# EAGLE schematic Arturo_Verasv2 (EAGLE 8.3.2)
Circuito Anti-jammer
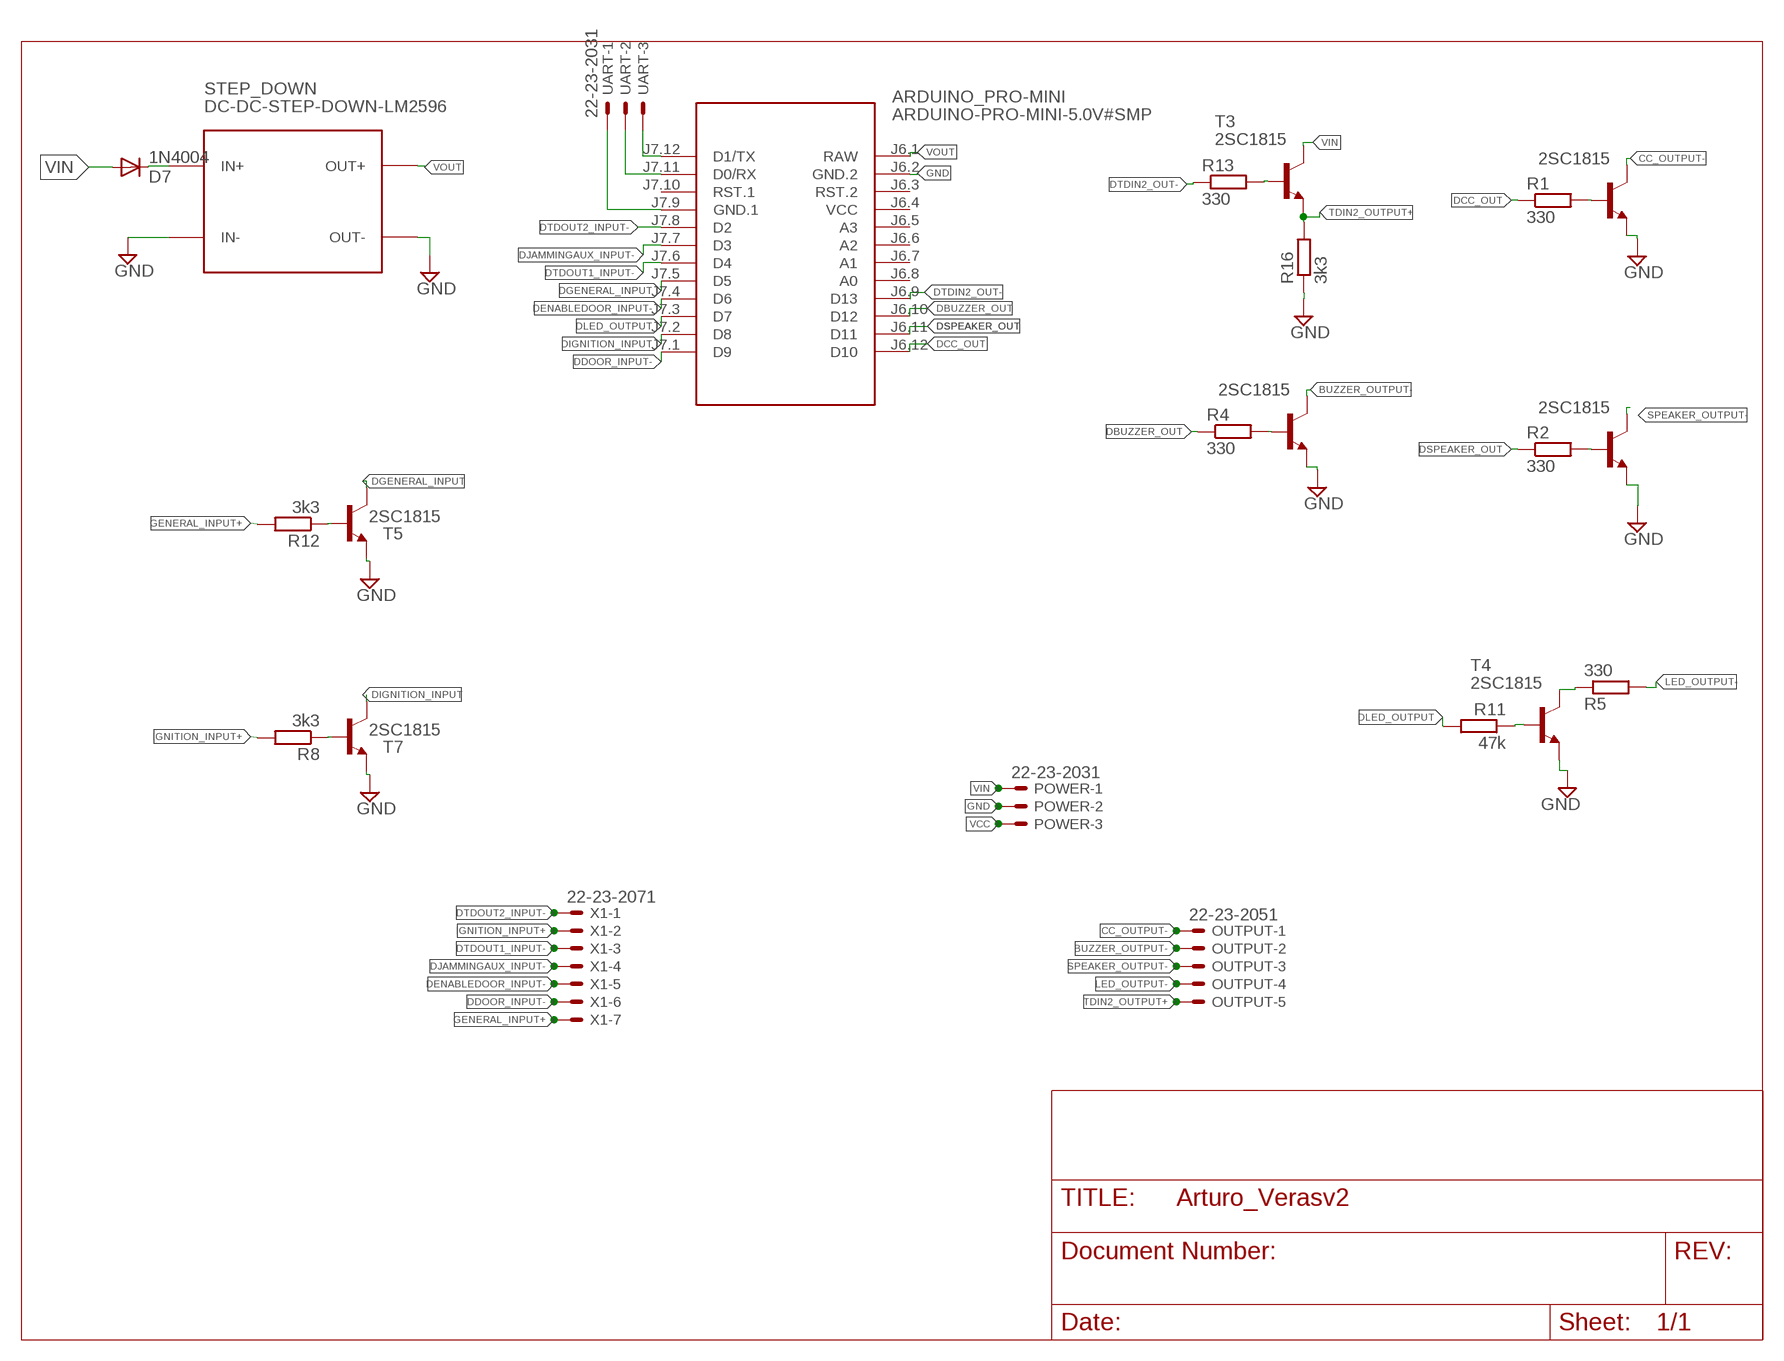
[diagram p0: schematic, sheet 1]

## Parts
ARDUINO_PRO-MINI  ARDUINO-PRO-MINI-5.0V#SMP  [ARDUINO-PRO-MINI#SMP]
D7  1N4004  [DO41-10]
OUTPUT  22-23-2051  [22-23-2051]
POWER  22-23-2031  [22-23-2031]
R1  330  R-EU_0204/7  [0204/7]
R2  330  R-EU_0204/7  [0204/7]
R4  330  R-EU_0204/7  [0204/7]
R5  330  R-EU_0204/7  [0204/7]
R8  3k3  R-EU_0204/7  [0204/7]
R11  47k  R-EU_0204/7  [0204/7]
R12  3k3  R-EU_0204/7  [0204/7]
R13  330  R-EU_0204/7  [0204/7]
R16  3k3  R-EU_0204/7  [0204/7]
STEP_DOWN  DC-DC-STEP-DOWN-LM2596  [DC-DC-STEP-DOWN-LM2596]
T1  2SC1815  [TO92-ECB]
T3  2SC1815  [TO92-ECB]
T4  2SC1815  [TO92-ECB]
T5  2SC1815  [TO92-ECB]
T6  2SC1815  [TO92-ECB]
T7  2SC1815  [TO92-ECB]
T8  2SC1815  [TO92-ECB]
UART  22-23-2031  [22-23-2031]
X1  22-23-2071  [22-23-2071]

## Nets
BUZZER_OUTPUT-: OUTPUT.2 T6.C
CC_OUTPUT-: OUTPUT.1 T8.C
DBUZZER_OUT: ARDUINO_PRO-MINI.J6.10(D12) R4.1
DCC_OUT: ARDUINO_PRO-MINI.J6.12(D10) R1.1
DDOOR_INPUT-: ARDUINO_PRO-MINI.J7.1(D9) X1.6
DENABLEDOOR_INPUT-: ARDUINO_PRO-MINI.J7.4(D6) X1.5
DGENERAL_INPUT: ARDUINO_PRO-MINI.J7.5(D5) T5.C
DIGNITION_INPUT: ARDUINO_PRO-MINI.J7.2(D8) T7.C
DJAMMINGAUX_INPUT-: ARDUINO_PRO-MINI.J7.7(D3) X1.4
DLED_OUTPUT: ARDUINO_PRO-MINI.J7.3(D7) R11.2
DSPEAKER_OUT: ARDUINO_PRO-MINI.J6.11(D11) R2.1
DTDIN2_OUT-: ARDUINO_PRO-MINI.J6.9(D13) R13.1
DTDOUT1_INPUT-: ARDUINO_PRO-MINI.J7.6(D4) X1.3
DTDOUT2_INPUT-: ARDUINO_PRO-MINI.J7.8(D2) X1.1
GENERAL_INPUT+: R12.2 X1.7
GND: ARDUINO_PRO-MINI.J6.2(GND.2) POWER.2 R16.1 STEP_DOWN.IN- STEP_DOWN.OUT- T1.E T4.E T5.E T6.E T7.E T8.E
IGNITION_INPUT+: R8.2 X1.2
LED_OUTPUT-: OUTPUT.4 R5.2
N$1: R12.1 T5.B
N$2: R13.2 T3.B
N$3: R1.2 T8.B
N$4: R2.2 T1.B
N$5: R4.2 T6.B
N$6: R5.1 T4.C
N$7: ARDUINO_PRO-MINI.J7.12(D1/TX) UART.3
N$8: ARDUINO_PRO-MINI.J7.11(D0/RX) UART.2
N$9: ARDUINO_PRO-MINI.J7.9(GND.1) UART.1
N$20: R11.1 T4.B
N$22: R8.1 T7.B
N$23: D7.C STEP_DOWN.IN+
SPEAKER_OUTPUT-: OUTPUT.3 T1.C
TDIN2_OUTPUT+: OUTPUT.5 R16.2 T3.E
VCC: POWER.3
VIN: D7.A POWER.1 T3.C
VOUT: ARDUINO_PRO-MINI.J6.1(RAW) STEP_DOWN.OUT+
Unconnected: ARDUINO_PRO-MINI.J6.3(RST.2) ARDUINO_PRO-MINI.J6.5(A3) ARDUINO_PRO-MINI.J6.6(A2) ARDUINO_PRO-MINI.J6.7(A1) ARDUINO_PRO-MINI.J6.8(A0) ARDUINO_PRO-MINI.J7.10(RST.1)

## Power pins joined to a net without a drawn wire
VCC: ARDUINO_PRO-MINI.J6.4(VCC)

## Library data of the parts
ARDUINO_PRO-MINI = diy-modules:ARDUINO-PRO-MINI-*#SMP: Arduino Pro Mini (and compatible devices) with 2 connectors only More details available here: https://www.arduino.cc/en/Main/ArduinoBoardProMini Click here to find device on ebay.com <http://www.ebay.com/sch/arduino+pro+mini>
D7 = diode:1N4004: DIODE general purpose rectifier, 1 A
OUTPUT = con-molex:22-23-2051: .100" (2.54mm) Center Header - 5 Pin; MF: MOLEX; MPN: 22-23-2051; OC_FARNELL: 1462952; OC_NEWARK: 38C9178
POWER UART = con-molex:22-23-2031: .100" (2.54mm) Center Header - 3 Pin; MF: MOLEX; MPN: 22-23-2031; OC_FARNELL: 1462950; OC_NEWARK: 30C0862
R1 R2 R4 R5 R8 R11-R13 R16 = resistor:R-EU_: RESISTOR, European symbol
STEP_DOWN = diy-modules:DC-DC-STEP-DOWN-LM2596: DC/DC Step-Down Regulator based on LM2596-ADJ chip LM2596 datasheet available here: http://www.ti.com/lit/ds/symlink/lm2596.pdf Click here to find device on ebay.com <http://www.ebay.com/sch/lm2596+power+regulator>
T1 T3-T8 = transistor:2SC1815: NPN EPITAXIAL TRANSISTOR Source: TOSHIBA .. 2SC1815 1.pdf
X1 = con-molex:22-23-2071: .100" (2.54mm) Center Header - 7 Pin; MF: MOLEX; MPN: 22-23-2071; OC_FARNELL: 1654534; OC_NEWARK: 56H0445